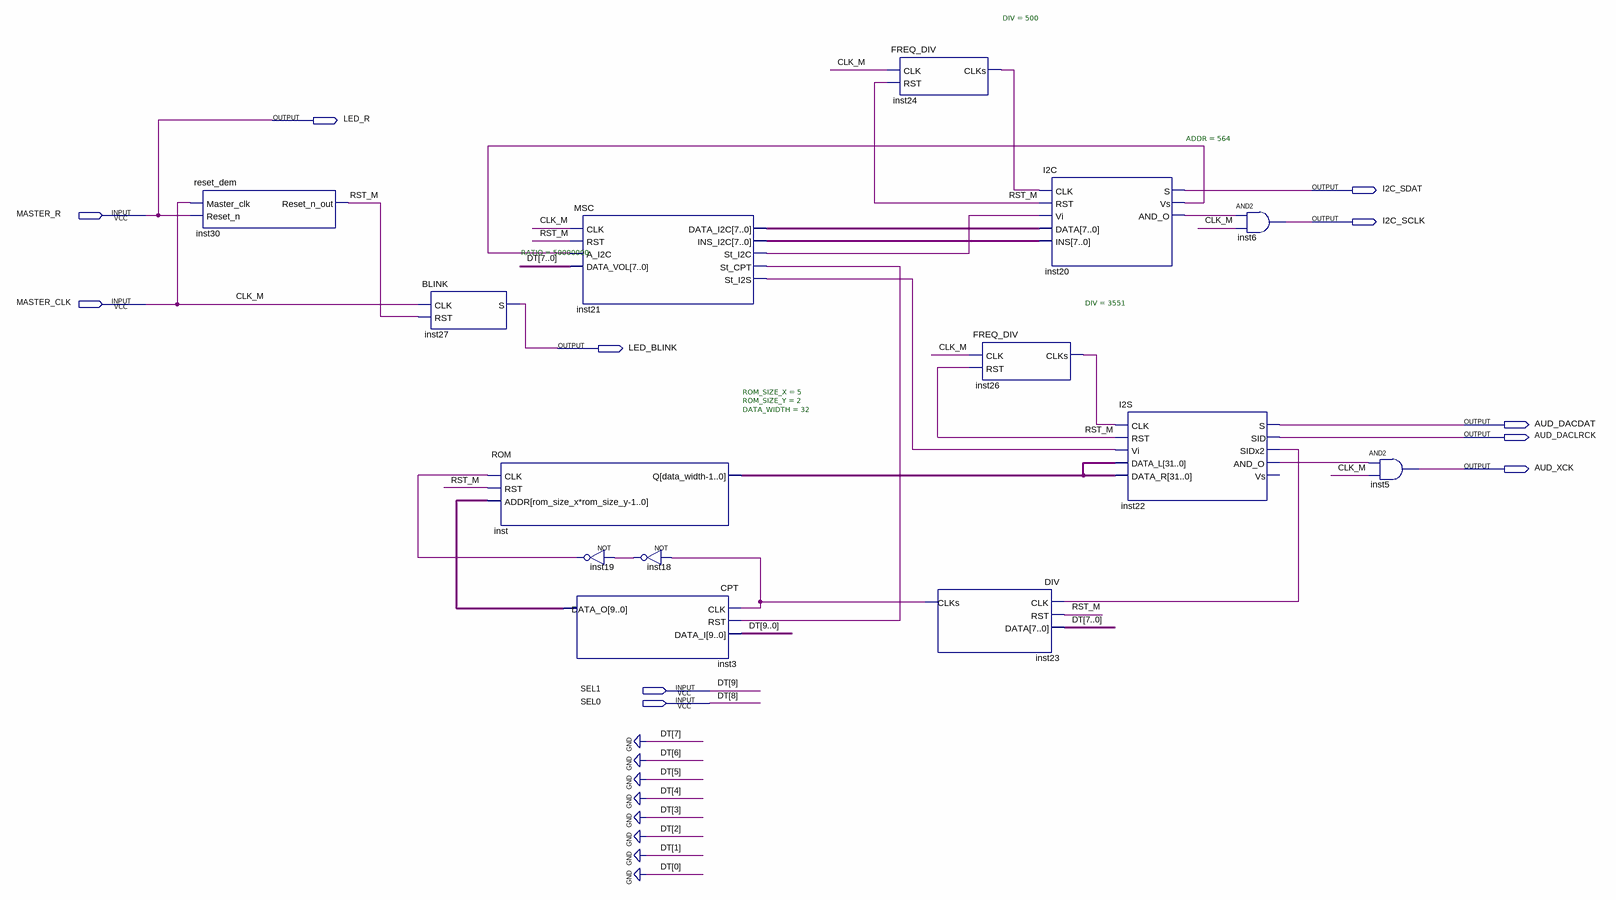
[diagram p0: schematic sheet]
// Quartus schematic main.bdf as structural Verilog: 14 symbols, 11 pins
module main (
  input  MASTER_R,
  input  MASTER_CLK,
  input  SEL1,
  input  SEL0,
  output LED_R,
  output I2C_SDAT,
  output I2C_SCLK,
  output LED_BLINK,
  output AUD_DACDAT,
  output AUD_DACLRCK,
  output AUD_XCK
);

  wire inst18_out, inst19_out, inst20_and_o, inst20_vs, inst21_st_cpt, inst21_st_i2c, inst21_st_i2s,
       inst22_and_o, inst22_sidx2, inst23_clks, inst24_clks, inst26_clks, RST_M;
  wire [7:0] inst21_data_i2c, inst21_ins_i2c;
  wire [9:0] inst3_data_o;
  wire [31:0] inst_q;

  reset_dem inst30 (.Master_clk(MASTER_CLK), .Reset_n(MASTER_R), .Reset_n_out(RST_M));
  BLINK #(.RATIO(50000000)) inst27 (.CLK(MASTER_CLK), .RST(RST_M), .S(LED_BLINK));
  ROM #(.ROM_SIZE_X(5), .ROM_SIZE_Y(2), .DATA_WIDTH(32)) inst (
    .CLK(inst19_out), .RST(RST_M), .ADDR(inst3_data_o), .Q(inst_q));
  MSC inst21 (
    .CLK(MASTER_CLK), .RST(RST_M), .A_I2C(inst20_vs), .DATA_VOL({8{1'b0}}), .DATA_I2C(inst21_data_i2c),
    .INS_I2C(inst21_ins_i2c), .St_I2C(inst21_st_i2c), .St_CPT(inst21_st_cpt), .St_I2S(inst21_st_i2s));
  not inst19 (inst19_out, inst18_out);
  CPT inst3 (.CLK(inst23_clks), .RST(inst21_st_cpt), .DATA_I({SEL1, SEL0, {8{1'b0}}}), .DATA_O(inst3_data_o));
  not inst18 (inst18_out, inst23_clks);
  FREQ_DIV #(.DIV(500)) inst24 (.CLK(MASTER_CLK), .RST(RST_M), .CLKs(inst24_clks));
  DIV inst23 (.CLK(inst22_sidx2), .RST(RST_M), .DATA({8{1'b0}}), .CLKs(inst23_clks));
  FREQ_DIV #(.DIV(3551)) inst26 (.CLK(MASTER_CLK), .RST(RST_M), .CLKs(inst26_clks));
  I2C #(.ADDR(564)) inst20 (
    .CLK(inst24_clks), .RST(RST_M), .Vi(inst21_st_i2c), .DATA(inst21_data_i2c), .INS(inst21_ins_i2c),
    .S(I2C_SDAT), .Vs(inst20_vs), .AND_O(inst20_and_o));
  I2S inst22 (
    .CLK(inst26_clks), .RST(RST_M), .Vi(inst21_st_i2s), .DATA_L(inst_q), .DATA_R(inst_q), .S(AUD_DACDAT),
    .SID(AUD_DACLRCK), .SIDx2(inst22_sidx2), .AND_O(inst22_and_o));  // open: Vs
  and inst6 (I2C_SCLK, inst20_and_o, MASTER_CLK);
  and inst5 (AUD_XCK, inst22_and_o, MASTER_CLK);

  assign LED_R = MASTER_R;

  // Other names for the same wires on the sheet: DT[9:8] = {SEL1, SEL0}; CLK_M = MASTER_CLK
endmodule
